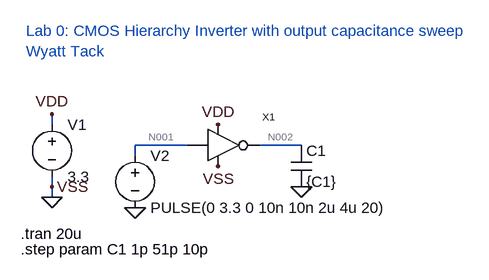
[diagram p0: schematic Lab 0 Inverter Capacitance.asc]
Lab 0 Inverter Capacitance.asc, the LTspice schematic file:
Version 4
SHEET 1 880 680
WIRE -224 128 -224 112
WIRE -16 160 -96 160
WIRE 160 160 96 160
WIRE -96 176 -96 160
WIRE -224 224 -224 208
WIRE -224 240 -224 224
FLAG -224 112 VDD
FLAG -224 224 VSS
FLAG -224 240 0
FLAG 32 128 VDD
FLAG 32 192 VSS
FLAG -96 256 0
FLAG 160 224 0
SYMBOL voltage -224 112 R0
WINDOW 123 0 0 Left 0
WINDOW 39 0 0 Left 0
SYMATTR InstName V1
SYMATTR Value 3.3
SYMBOL voltage -96 160 R0
WINDOW 123 0 0 Left 0
WINDOW 39 0 0 Left 0
SYMATTR InstName V2
SYMATTR Value PULSE(0 3.3 0 10n 10n 2u 4u 20)
SYMBOL Inverter 32 160 R0
SYMATTR InstName X1
SYMBOL cap 144 160 R0
SYMATTR InstName C1
SYMATTR Value {C1}
TEXT -272 296 Left 2 !.tran 20u
TEXT -272 320 Left 2 !.step param C1 1p 51p 10p
TEXT -264 -16 Left 2 ;Lab 0: CMOS Hierarchy Inverter with output capacitance sweep\nWyatt Tack

The netlist it stands for:
* Lab 0 Inverter Capacitance.asc
V1 VDD 0 3.3
V2 N001 0 PULSE(0 3.3 0 10n 10n 2u 4u 20)
XX1 N001 VDD 0 N002 Inverter  ; pins In VDD VSS Out
C1 N002 0 {C1}
.tran 20u
.step param C1 1p 51p 10p
* Lab 0: CMOS Hierarchy Inverter with output capacitance sweep
* Wyatt Tack
.backanno
.end

* Results of the author's LTspice run, read from the files saved beside the schematic
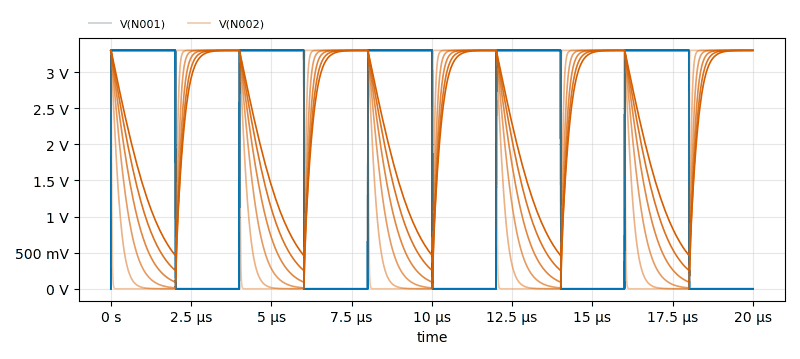
[diagram p1: Transient Analysis of Lab 0 Inverter Capacitance.asc, plotted from the saved traces]
* Transient Analysis, 6 runs:
*   V(N001) [c1=1e-12]: min 0 V, max 3.3 V, average 1.658 V, rms 2.337 V, last 0 V
*   V(N001) [c1=1.1e-11]: min 0 V, max 3.3 V, average 1.658 V, rms 2.337 V, last 0 V
*   V(N001) [c1=2.1e-11]: min 0 V, max 3.3 V, average 1.658 V, rms 2.337 V, last 0 V
*   V(N001) [c1=3.1e-11]: min 0 V, max 3.3 V, average 1.658 V, rms 2.337 V, last 0 V
*   V(N001) [c1=4.1e-11]: min 0 V, max 3.3 V, average 1.658 V, rms 2.338 V, last 0 V
*   V(N001) [c1=5.1e-11]: min 0 V, max 3.3 V, average 1.658 V, rms 2.338 V, last 0 V
*   V(N002) [c1=1e-12]: min 0 V, max 3.3 V, average 1.656 V, rms 2.33 V, last 3.3 V
*   V(N002) [c1=1.1e-11]: min 39.41 µV, max 3.3 V, average 1.784 V, rms 2.353 V, last 3.3 V
*   V(N002) [c1=2.1e-11]: min 12.12 mV, max 3.3 V, average 1.914 V, rms 2.378 V, last 3.3 V
*   V(N002) [c1=3.1e-11]: min 91.36 mV, max 3.3 V, average 2.039 V, rms 2.405 V, last 3.3 V
*   V(N002) [c1=4.1e-11]: min 252.1 mV, max 3.3 V, average 2.154 V, rms 2.438 V, last 3.3 V
*   V(N002) [c1=5.1e-11]: min 458.9 mV, max 3.3 V, average 2.255 V, rms 2.474 V, last 3.3 V